# Altium schematic sheet Sheet1.SchDoc
size A3; SheetNumber: 1; SheetTotal: 1
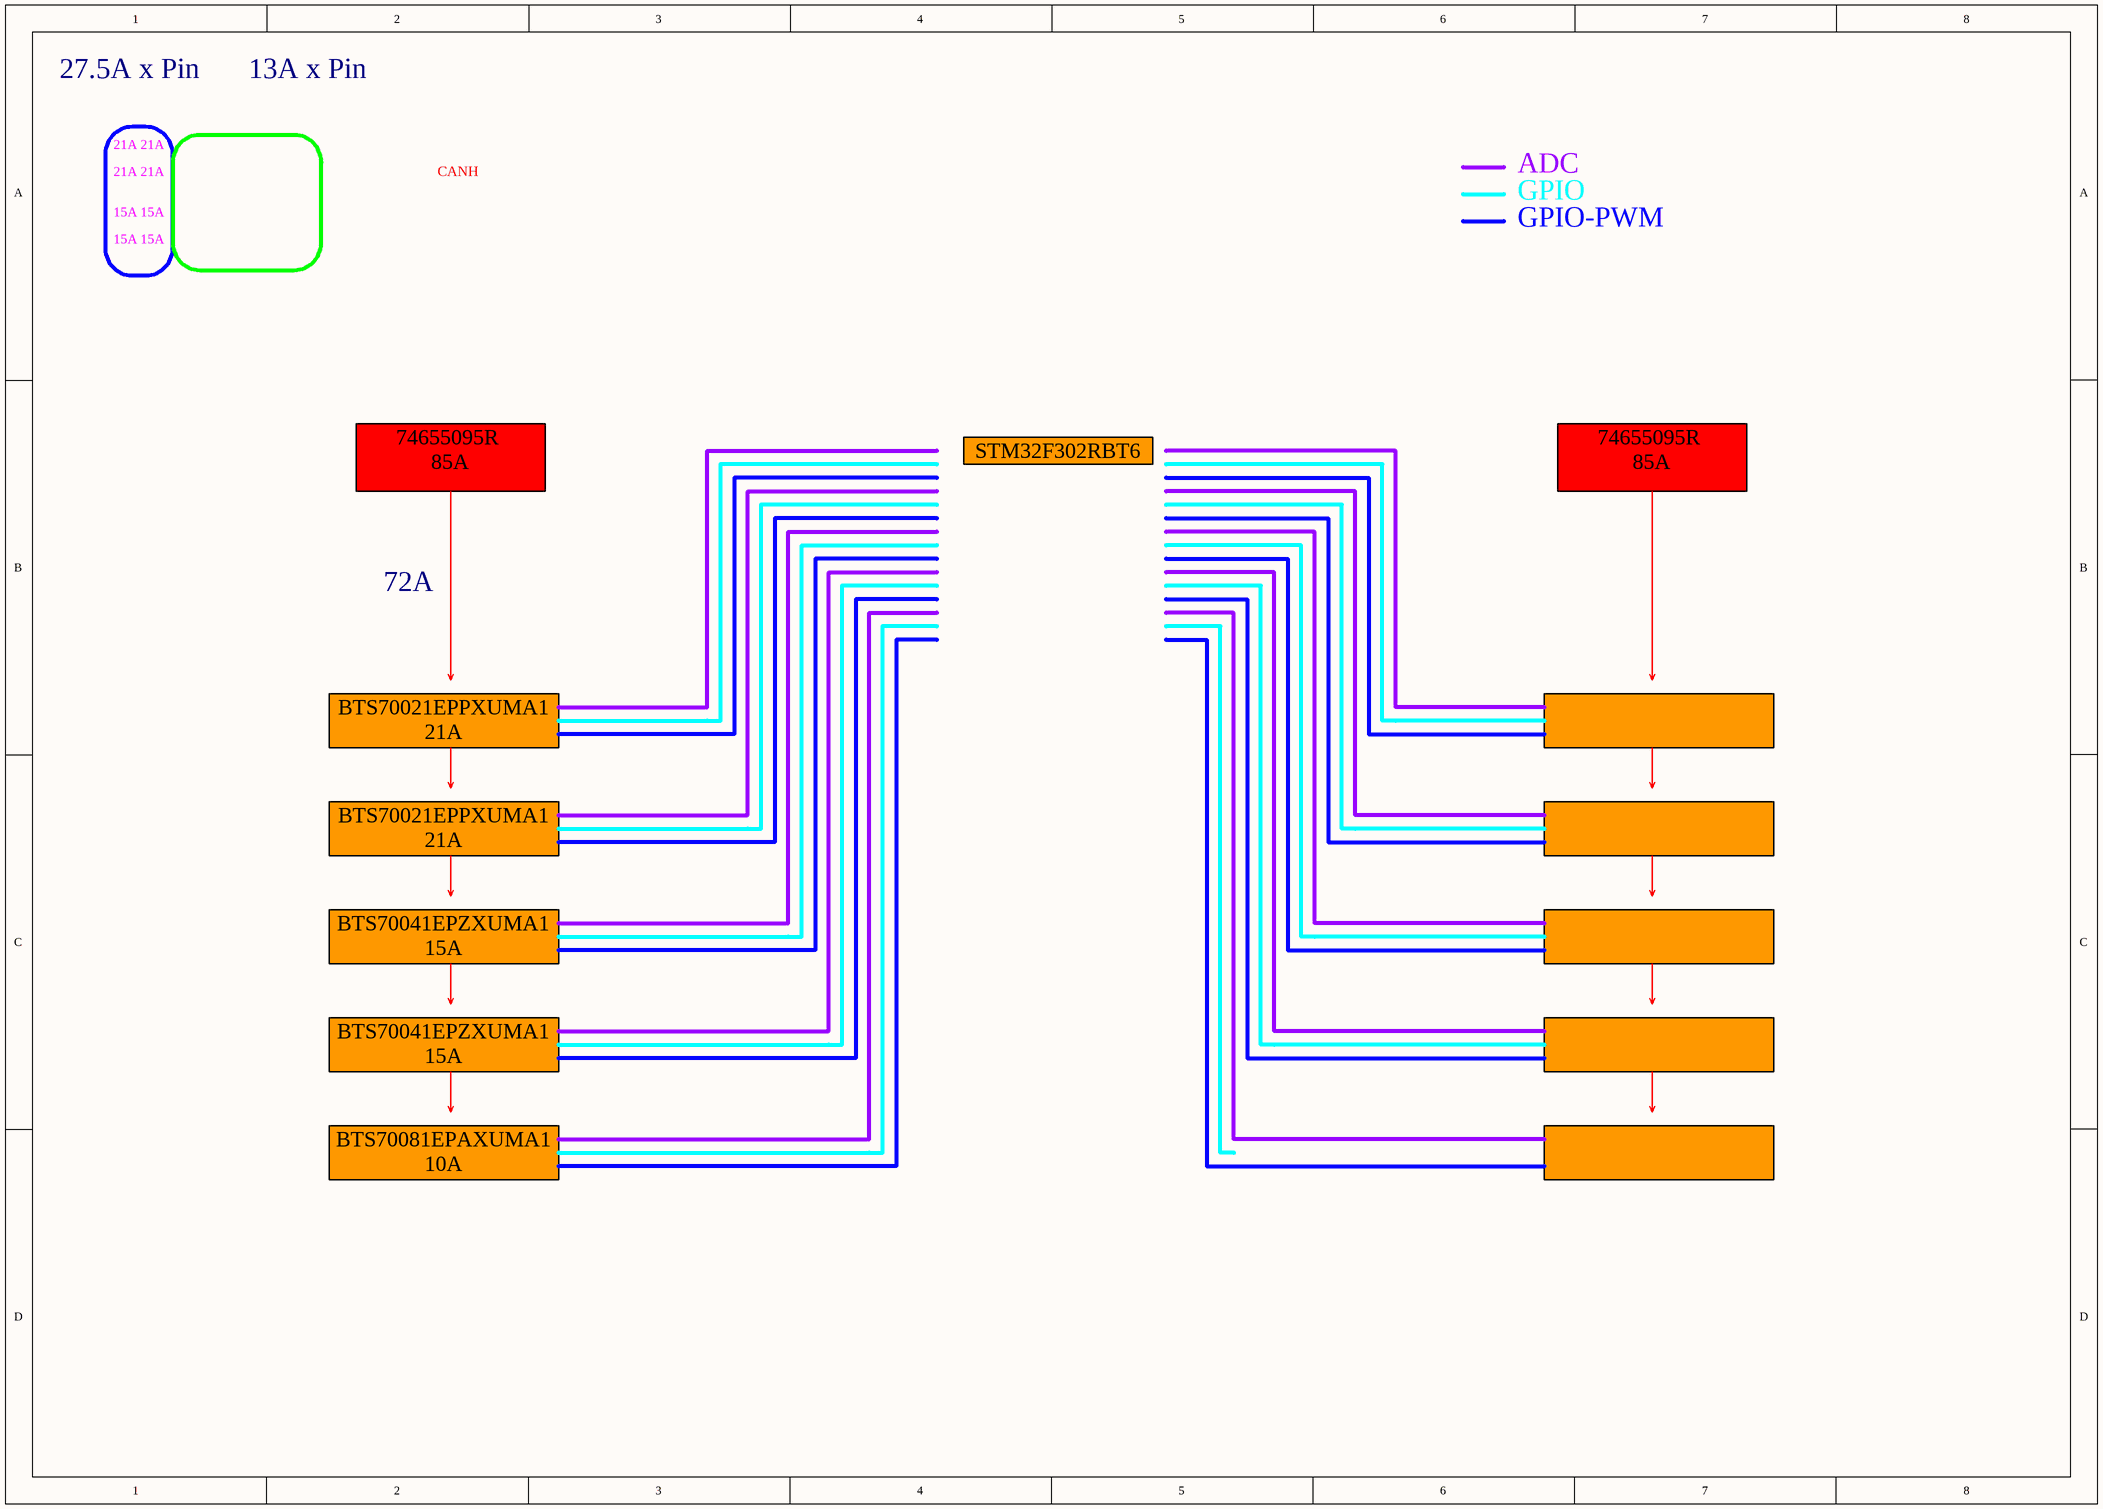
[diagram p0: Sheet1.SchDoc]

## Notes on the sheet
- 27.5A x Pin
- 13A x Pin
- 21A
- CANH
- ADC
- 15A
- GPIO
- GPIO-PWM
- 74655095R
  85A
- STM32F302RBT6
- 72A
- BTS70021EPPXUMA1
  21A
- BTS70041EPZXUMA1
  15A
- BTS70081EPAXUMA1
  10A